# EAGLE design oshi-fuse-board-mk-1_5x20mm (EAGLE 6.5.0)
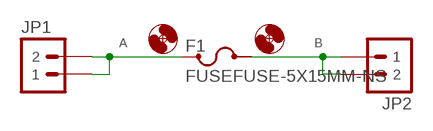
[diagram p0: schematic, sheet 1]

## Parts
F1  FUSEFUSE-5X15MM-NS  [FUSE-2AG-NS]
H1  HOLE#2  [HOLE-#2]
H2  HOLE#2  [HOLE-#2]
JP1  M023.5MM  [SCREWTERMINAL-3.5MM-2]
JP2  M023.5MM  [SCREWTERMINAL-3.5MM-2]

## Nets
A: F1.1 F1.1@1 JP1.1 JP1.2
B: F1.2 JP2.1 JP2.2

## Library data of the parts
F1 = A_butts:FUSE
H1 H2 = A_butts:HOLE: MOUNTING HOLE with drill center marker
JP1 JP2 = A_butts:M02: Standard 2-pin 0.1" header. Use with - straight break away headers ( PRT-00116) - right angle break away headers (PRT-00553) - swiss pins (PRT-00743) - machine pins (PRT-00117) - female headers (PRT-00115) Molex polarized connector foot print use with: PRT-08233 with associated crimp pins and housings. 2.54_SCREWTERM for use with PRT-10571. 3.5mm Screw Terminal footprints for PRT-08084 5mm Screw Terminal footprints for use with PRT-08433

## Board
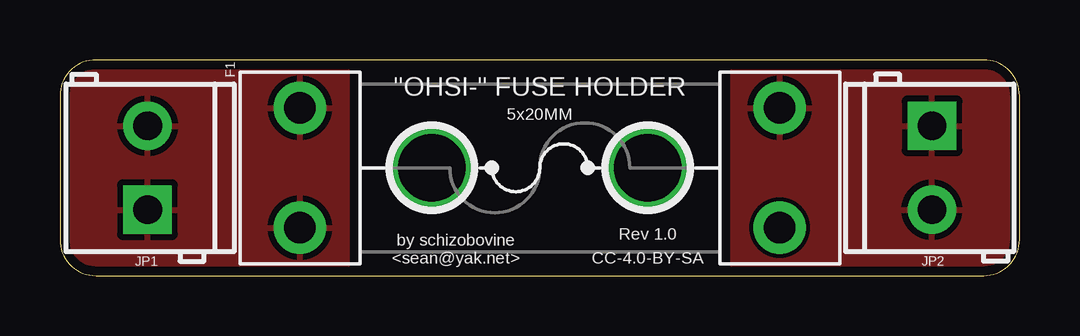
[diagram p1: board, top side]
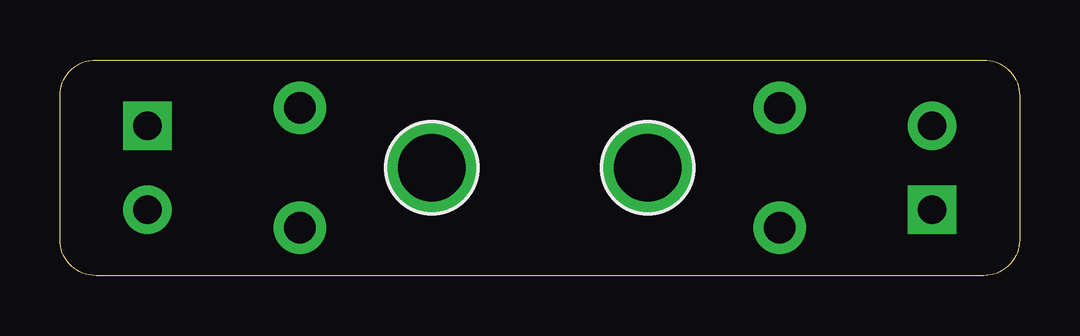
[diagram p2: board, bottom side, seen from below]

Size 40 x 9 mm. Coordinates in mm from the lower left corner, seen from the top.
Outline: 0,7.5 0,1.5 arc90 1.5,0 38.5,0 arc90 40,1.5 40,7.5 arc90 38.5,9 1.5,9 arc90 0,7.5
Copper layers (1*16): Top 0.0356mm / dielectric 1.5011mm / Bottom 0.0356mm
Design rules "LaenPCBOrder_2": minimum track width 6mil, minimum drill 13mil, track to track 6mil, track to pad 6mil, pad to pad 6mil, via to via 6mil, smd to smd 6mil, copper to edge 15mil, drill to drill 6mil, minimum pad ring 7mil, minimum via ring 7mil, stop-mask expansion 3mil, vias tented up to drill 20mil, thermal gap 10mil

### Footprints (pad centres in the part's own frame; a part is rotated, then mirrored left to right if it is on the bottom)
FUSE-2AG-NS = drill 1.3 pad 2.2: 1 -10,2.5; 1@1 -10,-2.5; 2 10,2.5; 2@2 10,-2.5
HOLE-#2 = drill 2.8 pad 3.81: P$1 0,0
SCREWTERMINAL-3.5MM-2 = drill 1.2 pad 2.032 square: 1 0,0 | drill 1.2 pad 2.032: 2 3.5,0

### Placement (x,y rotation side)
F1  20,4.5 0 top
H1  15.5,4.5 0 top
H2  24.5,4.5 0 top
JP1  3.65,2.75 90 top
JP2  36.35,6.25 270 top

### Tracks (layer width: path | path; a pad name or v marks a point on that pad's centre or on a via)
A
  pour Top: 12,0 1.5,0 arc-90 0,1.5 0,7.5 arc-90 1.5,9 12,9
B
  pour Top: 28,9 28,0 38.5,0 arc90 40,1.5 40,7.5 arc90 38.5,9

### Text on the board
tPlace: "OHSI-" FUSE HOLDER | 5x20MM | Rev 1.0 | by schizobovine / <sean@yak.net> | CC-4.0-BY-SA